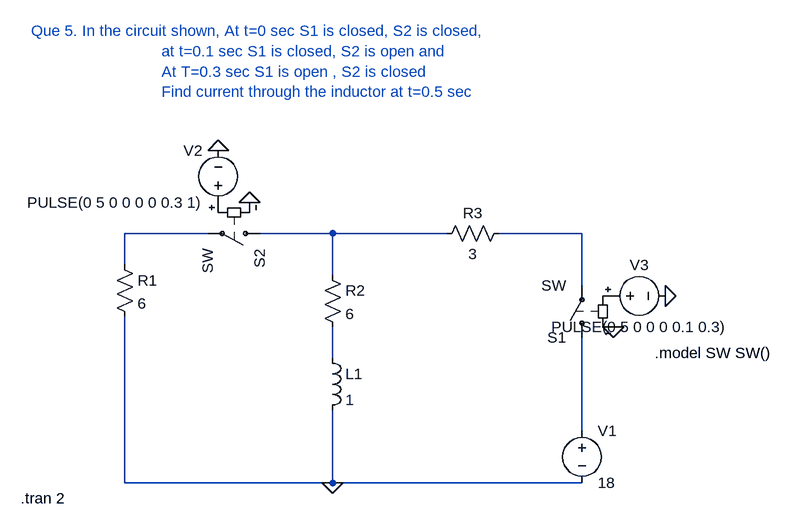
[diagram p0: schematic 5_Dheerendra_23EE019_transient.asc]
5_Dheerendra_23EE019_transient.asc, the LTspice schematic file:
Version 4
SHEET 1 1040 776
WIRE 160 352 32 352
WIRE 352 352 240 352
WIRE 528 352 352 352
WIRE 736 352 608 352
WIRE 32 400 32 352
WIRE 352 416 352 352
WIRE 736 432 736 352
WIRE 352 544 352 496
WIRE 736 656 736 512
WIRE 32 736 32 480
WIRE 352 736 352 624
WIRE 352 736 32 736
WIRE 736 736 352 736
FLAG 224 304 0
FLAG 176 224 0
FLAG 784 496 0
FLAG 352 736 0
FLAG 864 448 0
SYMBOL res 16 384 R0
SYMATTR InstName R1
SYMATTR Value 6
SYMBOL res 336 400 R0
SYMATTR InstName R2
SYMATTR Value 6
SYMBOL res 624 336 R90
WINDOW 0 0 56 VBottom 2
WINDOW 3 32 56 VTop 2
SYMATTR InstName R3
SYMATTR Value 3
SYMBOL ind 336 528 R0
SYMATTR InstName L1
SYMATTR Value 1
SYMBOL sw 736 528 R180
SYMATTR InstName S1
SYMBOL sw 256 352 R90
SYMATTR InstName S2
SYMBOL voltage 176 320 R180
WINDOW 0 24 96 Left 2
WINDOW 3 24 16 Left 2
WINDOW 123 0 0 Left 0
WINDOW 39 0 0 Left 0
SYMATTR InstName V2
SYMATTR Value PULSE(0 5 0 0 0 0 0.3 1)
SYMBOL voltage 768 448 R270
WINDOW 0 32 56 VTop 2
WINDOW 3 -32 56 VBottom 2
WINDOW 123 0 0 Left 0
WINDOW 39 0 0 Left 0
SYMATTR InstName V3
SYMATTR Value PULSE(0 5 0 0 0 0.1 0.3)
SYMBOL voltage 736 640 R0
WINDOW 123 0 0 Left 0
WINDOW 39 0 0 Left 0
SYMATTR InstName V1
SYMATTR Value 18
TEXT -112 40 Left 2 ;Que 5. In the circuit shown, At t=0 sec S1 is closed, S2 is closed, \n                             at t=0.1 sec S1 is closed, S2 is open and \n                             At T=0.3 sec S1 is open , S2 is closed \n                             Find current through the inductor at t=0.5 sec
TEXT 848 536 Left 2 !.model SW SW()
TEXT -128 760 Left 2 !.tran 2

The netlist it stands for:
* 5_Dheerendra_23EE019_transient.asc
R1 N001 0 6
R2 N002 N004 6
R3 N003 N002 3
L1 N004 0 1
S1 N005 N003 P001 0 SW
S2 N002 N001 P002 0 SW
V2 P002 0 PULSE(0 5 0 0 0 0 0.3 1)
V3 P001 0 PULSE(0 5 0 0 0 0.1 0.3)
V1 N005 0 18
* Que 5. In the circuit shown, At t=0 sec S1 is closed, S2 is closed,
*                              at t=0.1 sec S1 is closed, S2 is open and
*                              At T=0.3 sec S1 is open , S2 is closed
*                              Find current through the inductor at t=0.5 sec
.model SW SW()
.tran 2
.backanno
.end